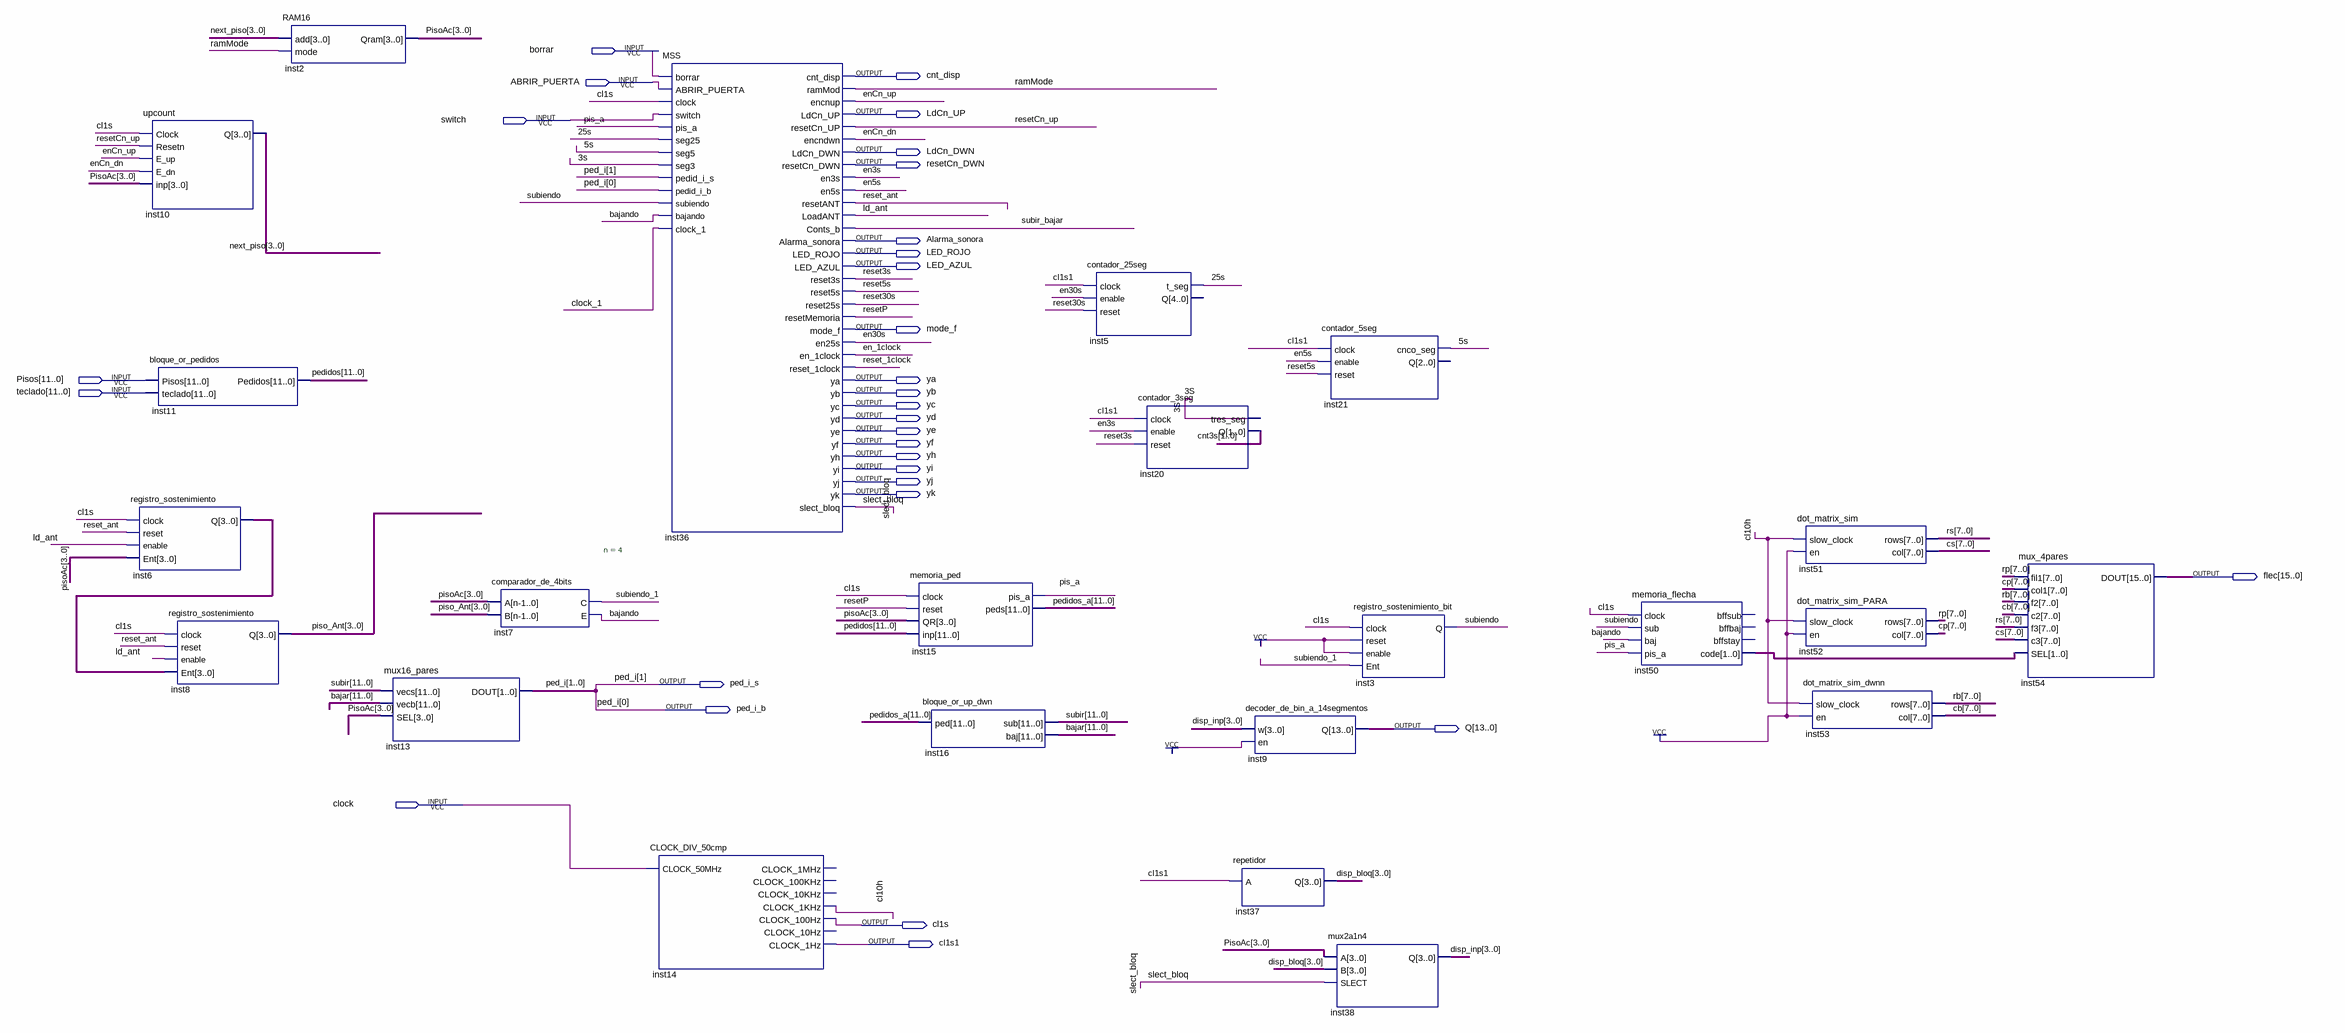
[diagram p0: schematic sheet]
// Quartus schematic mss1_en_segundos.bdf as structural Verilog: 23 symbols, 30 pins
module mss1_en_segundos (
  input  borrar,
  input  ABRIR_PUERTA,
  input  switch,
  input  [11:0] Pisos,
  input  [11:0] teclado,
  input  clock,
  output cnt_disp,
  output LdCn_UP,
  output LdCn_DWN,
  output resetCn_DWN,
  output Alarma_sonora,
  output LED_ROJO,
  output LED_AZUL,
  output mode_f,
  output ya,
  output yb,
  output yc,
  output yd,
  output ye,
  output yf,
  output yh,
  output yi,
  output yj,
  output yk,
  output [15:0] flec,
  output ped_i_s,
  output ped_i_b,
  output [13:0] Q,
  output cl1s,
  output cl1s1
);

  wire \3s , \5s , \25s , bajando, cl10h, clock_1, en3s, en5s, en30s, en_1clock, enCn_dn, enCn_up, ld_ant,
       pis_a, ramMode, reset3s, reset5s, reset30s, reset_1clock, reset_ant, resetCn_up, resetP, slect_bloq,
       subiendo, subiendo_1, subir_bajar;
  wire [1:0] cnt3s, inst50_code;
  wire [3:0] disp_bloq, disp_inp, inst6_q, next_piso, piso_Ant, pisoAc;
  wire [7:0] cb, cp, cs, rb, rp, rs;
  wire [11:0] bajar, pedidos, pedidos_a, subir;

  registro_sostenimiento inst6 (.clock(cl1s), .reset(reset_ant), .enable(ld_ant), .Ent(pisoAc), .Q(inst6_q));
  upcount inst10 (.Clock(cl1s), .Resetn(resetCn_up), .E_up(enCn_up), .E_dn(enCn_dn), .inp(pisoAc), .Q(next_piso));
  bloque_or_pedidos inst11 (.Pisos(Pisos), .teclado(teclado), .Pedidos(pedidos));
  registro_sostenimiento inst8 (.clock(cl1s), .reset(reset_ant), .enable(ld_ant), .Ent(inst6_q), .Q(piso_Ant));
  RAM16 inst2 (.add(next_piso), .mode(ramMode), .Qram(pisoAc));
  mux16_pares inst13 (.vecs(subir), .vecb(bajar), .SEL(pisoAc), .DOUT({ped_i_s, ped_i_b}));
  comparador_de_4bits #(.n(4)) inst7 (.A(pisoAc), .B(piso_Ant), .C(subiendo_1), .E(bajando));
  MSS inst36 (
    .borrar(borrar), .ABRIR_PUERTA(ABRIR_PUERTA), .clock(cl1s), .switch(switch), .pis_a(pis_a),
    .seg25(\25s ), .seg5(\5s ), .seg3(\3s ), .pedid_i_s(ped_i_s), .pedid_i_b(ped_i_b), .subiendo(subiendo),
    .bajando(bajando), .clock_1(clock_1), .cnt_disp(cnt_disp), .ramMod(ramMode), .encnup(enCn_up),
    .LdCn_UP(LdCn_UP), .resetCn_UP(resetCn_up), .encndwn(enCn_dn), .LdCn_DWN(LdCn_DWN),
    .resetCn_DWN(resetCn_DWN), .en3s(en3s), .en5s(en5s), .resetANT(reset_ant), .LoadANT(ld_ant),
    .Conts_b(subir_bajar), .Alarma_sonora(Alarma_sonora), .LED_ROJO(LED_ROJO), .LED_AZUL(LED_AZUL),
    .reset3s(reset3s), .reset5s(reset5s), .reset25s(reset30s), .resetMemoria(resetP), .mode_f(mode_f),
    .en25s(en30s), .en_1clock(en_1clock), .reset_1clock(reset_1clock), .ya(ya), .yb(yb), .yc(yc), .yd(yd),
    .ye(ye), .yf(yf), .yh(yh), .yi(yi), .yj(yj), .yk(yk), .slect_bloq(slect_bloq));
  CLOCK_DIV_50cmp inst14 (
    .CLOCK_50MHz(clock), .CLOCK_1KHz(cl10h), .CLOCK_100Hz(cl1s), .CLOCK_1Hz(cl1s1));  // open: CLOCK_1MHz, CLOCK_100KHz, CLOCK_10KHz, CLOCK_10Hz
  memoria_ped inst15 (.clock(cl1s), .reset(resetP), .QR(pisoAc), .inp(pedidos), .pis_a(pis_a), .peds(pedidos_a));
  bloque_or_up_dwn inst16 (.ped(pedidos_a), .sub(subir), .baj(bajar));
  contador_25seg inst5 (.clock(cl1s1), .enable(en30s), .reset(reset30s), .t_seg(\25s ));  // open: Q
  contador_3seg inst20 (.clock(cl1s1), .enable(en3s), .reset(reset3s), .tres_seg(\3s ), .Q(cnt3s));
  decoder_de_bin_a_14segmentos inst9 (.w(disp_inp), .en(1'b1), .Q(Q));
  repetidor inst37 (.A(cl1s1), .Q(disp_bloq));
  contador_5seg inst21 (.clock(cl1s1), .enable(en5s), .reset(reset5s), .cnco_seg(\5s ));  // open: Q
  mux2a1n4 inst38 (.A(pisoAc), .B(disp_bloq), .SLECT(slect_bloq), .Q(disp_inp));
  registro_sostenimiento_bit inst3 (.clock(cl1s), .reset(1'b1), .enable(1'b1), .Ent(subiendo_1), .Q(subiendo));
  memoria_flecha inst50 (
    .clock(cl1s), .sub(subiendo), .baj(bajando), .pis_a(pis_a), .code(inst50_code));  // open: bffsub, bffbaj, bffstay
  dot_matrix_sim inst51 (.slow_clock(cl10h), .en(1'b1), .rows(rs), .col(cs));
  dot_matrix_sim_PARA inst52 (.slow_clock(cl10h), .en(1'b1), .rows(rp), .col(cp));
  dot_matrix_sim_dwnn inst53 (.slow_clock(cl10h), .en(1'b1), .rows(rb), .col(cb));
  mux_4pares inst54 (.fil1(rp), .col1(cp), .f2(rb), .c2(cb), .f3(rs), .c3(cs), .SEL(inst50_code), .DOUT(flec));

  // Other names for the same wires on the sheet: ped_i[1:0] = {ped_i_s, ped_i_b}
endmodule
